# Altium project Antenny_v6.PrjPcb (part 1 of 2)
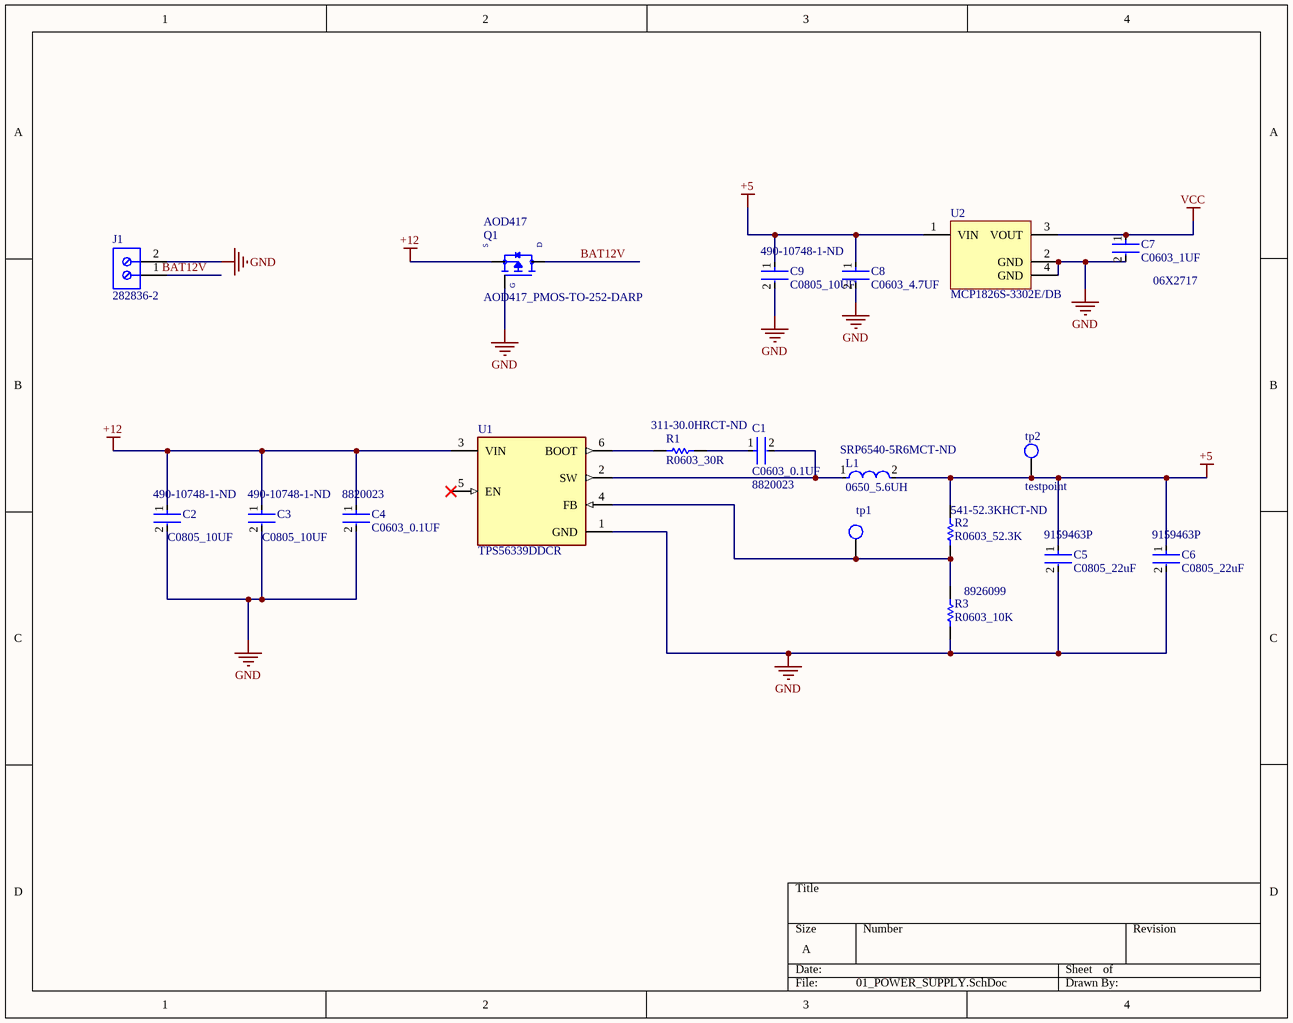
[diagram p0: 01_POWER_SUPPLY.SchDoc]
6 sheets, 81 parts. Net scope: global (net labels, ports and power ports of the same name join across sheets).
Board file: Antenny_v6.PcbDoc
Sheets:
  01_POWER_SUPPLY.SchDoc
  02_USB2UART.SchDoc
  03_PUSHBUTTON.SchDoc
  04_PWMDRIVER.SchDoc
  05_ESP32.SchDoc
  06_LED_ARRAY.SchDoc

## Sheet 01_POWER_SUPPLY.SchDoc
size A; SheetNumber: 1; SheetTotal: 6

### Parts
C1  C0603_0.1UF  Supplier Part Number 1: 8820023  [FP-C0603C-CF-IPC_B]
C2  C0805_10UF  Supplier Part Number 1: 490-10748-1-ND  [FP-C0805C-DN-IPC_A]
C3  C0805_10UF  Supplier Part Number 1: 490-10748-1-ND  [FP-C0805C-DN-IPC_A]
C4  C0603_0.1UF  Supplier Part Number 1: 8820023  [FP-C0603C-CF-IPC_B]
C5  C0805_22uF  Supplier Part Number 1: 9159463P  [FP-C0805C-DN-IPC_A]
C6  C0805_22uF  Supplier Part Number 1: 9159463P  [FP-C0805C-DN-IPC_A]
C7  C0603_1UF  Supplier Part Number 1: 06X2717  [FP-C0603C-CF-IPC_B]
C8  C0603_4.7UF  [FP-C0603C-CF-IPC_B]
C9  C0805_10UF  Supplier Part Number 1: 490-10748-1-ND  [FP-C0805C-DN-IPC_A]
J1  282836-2  [TECO-282836-2_V]
L1  0650_5.6UH  Supplier Part Number 1: SRP6540-5R6MCT-ND  [FP-SRP6540-MFG]
Q1  AOD417_PMOS-TO-252-DARP  Supplier Part Number 1: AOD417  [DPAK228P994X240_3N]
R1  R0603_30R  Supplier Part Number 1: 311-30.0HRCT-ND  [RESC1609X55X30LL15T15]
R2  R0603_52.3K  Supplier Part Number 1: 541-52.3KHCT-ND  [RESC1609X55X30LL15T15]
R3  R0603_10K  Supplier Part Number 1: 8926099  [RESC1609X55X30LL15T15]
tp1  testpoint  [testpoint_1mm]  (value not drawn)
tp2  testpoint  [testpoint_1mm]
U1  TPS56339DDCR  [FP-DDC0006A-MFG]
U2  MCP1826S-3302E/DB  [SOT-223-DB3_L]

### Nets
+5: C5.1 C6.1 C8.1 C9.1 L1.2 R2.2 tp2.1 U2.1(VIN)
+12: C2.1 C3.1 C4.1 Q1.3(S) U1.3(VIN)
GND: C2.2 C3.2 C4.2 C5.2 C6.2 C7.2 C8.2 C9.2 J1.2 Q1.1(G) R3.1 U1.1(GND) U2.2(GND) U2.4(GND)
VCC: C7.1 U2.3(VOUT)
BAT12V: J1.1 Q1.4(D)
NetC1_1: C1.1 R1.2
NetC1_2: C1.2 L1.1 U1.2(SW)
NetR1_1: R1.1 U1.6(BOOT)
NetR2_1: R2.1 R3.2 tp1.1 U1.4(FB)

Not connected (* = marked no-connect by the designer): U1 5(EN)*

### Library data of the parts
C1 C4 = C0603: Multilayer Ceramic Capacitors MLCC Surface Mount 0603 0.1uF 50 Volts X7R 10%; Manufacturer: Murata; Manufacturer Part Number: GRM188R71H104KA93D; Capacitance: 100nF; Voltage Rating: 50V; Insulation Resistance: 10GR; Supplier 1: Farnell; RoHS: Yes; Category: Ceramic Capacitors; Pricing 1: 10=0.04520, 100=0.02000, 500=0.01550, 1000=0.01360, 2000=0.01130, 4000=0.00980, 20000=0.00730, 40000=0.00720 (GBP); Mount: Surface Mount; Case/Package: 0603; Number of Pins: 2; Case Code (Imperial): 0603; Case Code (Metric): 1608; Material: Ceramic; Contact Plating: Tin,Matte; Dielectric Material: Ceramic; Min Operating Temperature: -55°C; Max Operating Temperature: 125°C; Tolerance: 10%; Dielectric: X7R; Packaging: Tape and Reel; Voltage Rating (DC): 50V; Package Quantity: 1; Termination: SMD/SMT; Voltage: 50V; Length: 1.6mm; Width: 0.8mm; Height: 0.8mm; Thickness: 0.035inch; Depth: 0.8mm; Radiation Hardening: No; REACH SVHC: No SVHC; Lead Free: Lead Free; RoHS Compliant: Yes; ComponentLink1URL: https://datasheet.ciiva.com/19467/1857604-19467681.pdf?src-supplier=Jameco; ComponentLink1Description: https://datasheet.ciiva.com/19467/1857604-19467681.pdf?src-supplier=Jameco; ComponentLink2URL: https://datasheet.ciiva.com/11786/0900766b807a1cab-11786047.pdf?src-supplier=RSComponents; ComponentLink2Description: https://datasheet.ciiva.com/11786/0900766b807a1cab-11786047.pdf?src-supplier=RSComponents; ComponentLink3URL: https://datasheet.ciiva.com/29201/451744-da-01-en-vs-kondensator-0603-29201904.pdf?src-supplier=Conrad; ComponentLink3Description: https://datasheet.ciiva.com/29201/451744-da-01-en-vs-kondensator-0603-29201904.pdf?src-supplier=Conrad; ComponentLink4URL: https://datasheet.ciiva.com/131/partnumbering-e-01-131738.pdf?src-supplier=Digi-Key; ComponentLink4Description: https://datasheet.ciiva.com/131/partnumbering-e-01-131738.pdf?src-supplier=Digi-Key; ComponentLink5URL: https://datasheet.ciiva.com/131/partnumbering-e-01-131739.pdf?src-supplier=Digi-Key; ComponentLink5Description: https://datasheet.ciiva.com/131/partnumbering-e-01-131739.pdf?src-supplier=Digi-Key; ComponentLink6URL: https://datasheet.ciiva.com/131/partnumbering-e-01-131740.pdf?src-supplier=Digi-Key; ComponentLink6Description: https://datasheet.ciiva.com/131/partnumbering-e-01-131740.pdf?src-supplier=Digi-Key; ComponentLink7URL: https://datasheet.ciiva.com/48436/nmgrm-data-en-48436667.pdf?src-supplier=Distrelec; ComponentLink7Description: https://datasheet.ciiva.com/48436/nmgrm-data-en-48436667.pdf?src-supplier=Distrelec; ComponentLink8URL: https://datasheet.ciiva.com/14116/nmgrm-data-en-14116602.pdf?src-supplier=Distrelec; ComponentLink8Description: https://datasheet.ciiva.com/14116/nmgrm-data-en-14116602.pdf?src-supplier=Distrelec; ComponentLink9URL: https://datasheet.ciiva.com/28534/4360-28534245.pdf?src-supplier=Element14; ComponentLink9Description: https://datasheet.ciiva.com/28534/4360-28534245.pdf?src-supplier=Element14; ComponentLink10URL: https://datasheet.ciiva.com/7937/4360-7937659.pdf?src-supplier=Element14; ComponentLink10Description: https://datasheet.ciiva.com/7937/4360-7937659.pdf?src-supplier=Element14; ComponentLink11URL: https://datasheet.ciiva.com/7937/1747470-7937658.pdf?src-supplier=Element14; ComponentLink11Description: https://datasheet.ciiva.com/7937/1747470-7937658.pdf?src-supplier=Element14
C2 C3 C9 = C0805: MURATA - GRM21BR61E106MA73L - SMD Multilayer Ceramic Capacitor, 10 µF, 25 V, 0805 [2012 Metric], ± 20%, X5R, GRM Series; Capacitance: 10uF; Voltage Rating: 25V; ComponentLink2Description: Datasheet; ComponentLink2URL: https://content.kemet.com/datasheets/KEM_C1003_C0G_SMD.pdf; Supplier 1: Digi-Key; Manufacturer: Murata; Manufacturer Part Number: GRM21BR61E106MA73L; RoHS: Yes; Category: Ceramic Capacitors; Pricing 1: 1=0.26000, 10=0.17900, 50=0.11960, 100=0.10170, 500=0.07176, 1000=0.06279 (USD); Mount: Surface Mount; Case/Package: 0805; Case Code (Metric): 2012; Case Code (Imperial): 0805; Weight: 0.000335oz; Min Operating Temperature: -55°C; Max Operating Temperature: 85°C; Tolerance: 20%; Packaging: Tape and Reel; Dielectric: X5R; Termination: SMD/SMT; Resistor Type: Ceramic; Voltage Rating (DC): 25V; Package Quantity: 3000; Length: 2mm; Width: 0.049inch; Height: 1.25mm; Thickness: 0.055inch; Depth: 1.25mm; REACH SVHC: No SVHC; Lead Free: Lead Free; RoHS Compliant: Yes; ComponentLink1URL: http://www.farnell.com/datasheets/2079185.pdf?src-supplier=Farnell; ComponentLink1Description: http://www.farnell.com/datasheets/2079185.pdf?src-supplier=Farnell; ComponentLink3URL: http://www.mouser.com/ds/2/281/c02e-2905.pdf?src-supplier=Mouser; ComponentLink3Description: http://www.mouser.com/ds/2/281/c02e-2905.pdf?src-supplier=Mouser; ComponentLink4URL: http://components.arrow.com/part/dataview/0323_03061623?src-supplier=Arrow+Europe; ComponentLink4Description: http://components.arrow.com/part/dataview/0323_03061623?src-supplier=Arrow+Europe; ComponentLink5URL: https://search.murata.co.jp/Ceramy/image/img/A01X/G101/ENG/GRM21BR61E106MA73-01.pdf?src-supplier=Digi-Key; ComponentLink5Description: https://search.murata.co.jp/Ceramy/image/img/A01X/G101/ENG/GRM21BR61E106MA73-01.pdf?src-supplier=Digi-Key; ComponentLink6URL: http://www.farnell.com/datasheets/2079185.pdf?src-supplier=Element14; ComponentLink6Description: http://www.farnell.com/datasheets/2079185.pdf?src-supplier=Element14
  C2 C3: Stock 1: 272100
  C9: Stock 1: 263487
C5 C6 = C0805: TDK - C2012X7S1A226M125AC - SMD Multilayer Ceramic Capacitor, 22 µF, 10 V, 0805 [2012 Metric], ± 20%, X7S, C Series; Capacitance: 22uF; Voltage Rating: 10V; ComponentLink2Description: Datasheet; ComponentLink2URL: https://content.kemet.com/datasheets/KEM_C1003_C0G_SMD.pdf; Supplier 1: RSComponents; Manufacturer: TDK; Manufacturer Part Number: C2012X7S1A226M125AC; RoHS: Yes; Category: Ceramic Capacitors; Stock 1: 1; Pricing 1: 5=0.92400, 25=0.86000, 100=0.75800, 250=0.62800, 500=0.51700 (USD); Mount: Surface Mount; Case/Package: 0805; Case Code (Metric): 2012; Case Code (Imperial): 0805; Weight: 0.000194oz; Dielectric Material: Ceramic; Min Operating Temperature: -55°C; Max Operating Temperature: 125°C; Package Quantity: 2000; Packaging: Tape and Reel; Tolerance: 20%; Dielectric: X7S; Termination: SMD/SMT; Voltage Rating (DC): 10V; Series: C; Length: 0.079inch; Width: 1.25mm; Height: 1.25mm; Thickness: 0.057inch; REACH SVHC: No SVHC; Lead Free: Lead Free; RoHS Compliant: Yes; ComponentLink1URL: https://datasheet.ciiva.com/14893/tdkmlcccaprange-14893287.pdf?src-supplier=Digi-Key; ComponentLink1Description: https://datasheet.ciiva.com/14893/tdkmlcccaprange-14893287.pdf?src-supplier=Digi-Key; ComponentLink3URL: https://datasheet.ciiva.com/14893/tdkmlcccaprange-14893288.pdf?src-supplier=Digi-Key; ComponentLink3Description: https://datasheet.ciiva.com/14893/tdkmlcccaprange-14893288.pdf?src-supplier=Digi-Key; ComponentLink4URL: https://datasheet.ciiva.com/14893/tdkmlcccaprange-14893289.pdf?src-supplier=Digi-Key; ComponentLink4Description: https://datasheet.ciiva.com/14893/tdkmlcccaprange-14893289.pdf?src-supplier=Digi-Key
C7 = C0603: 0603 1 uF 50 V ±10% Tolerance X5R Surface Mount Multilayer Ceramic Capacitor; Manufacturer: Taiyo Yuden; Manufacturer Part Number: UMK107BJ105KA-T; Capacitance: 1uF; Voltage Rating: 50V; Supplier 1: Newark; RoHS: Yes; Category: Ceramic Capacitors; Stock 1: 80000; Pricing 1: 4000=0.05100, 8000=0.04300, 16000=0.03800, 24000=0.03500 (USD); Mount: Surface Mount; Case/Package: 0603; Number of Pins: 2; Case Code (Metric): 1608; Case Code (Imperial): 0603; Contact Plating: Nickel; Min Operating Temperature: -55°C; Max Operating Temperature: 85°C; Tolerance: 10%; Packaging: Tape and Reel; Package Quantity: 1; Voltage Rating (DC): 50V; Termination: SMD/SMT; Dielectric: X5R; Series: M; Construction: Flat; Length: 1.6mm; Width: 0.031inch; Height: 0.8mm; Depth: 0.8mm; Thickness: 0.035inch; Radiation Hardening: No; REACH SVHC: Unknown; RoHS Compliant: Yes; Halogen Free: Halogen Free; ComponentLink1URL: https://datasheet.ciiva.com/134/umk107bj105ka-t-ss-134740.pdf?src-supplier=Digi-Key; ComponentLink1Description: https://datasheet.ciiva.com/134/umk107bj105ka-t-ss-134740.pdf?src-supplier=Digi-Key; ComponentLink2URL: https://datasheet.ciiva.com/11601/umk107bj105ka-t-ss-11601811.pdf?src-supplier=Avnet; ComponentLink2Description: https://datasheet.ciiva.com/11601/umk107bj105ka-t-ss-11601811.pdf?src-supplier=Avnet; ComponentLink3URL: https://datasheet.ciiva.com/5744/1697715-5744913.pdf?src-supplier=Farnell; ComponentLink3Description: https://datasheet.ciiva.com/5744/1697715-5744913.pdf?src-supplier=Farnell; ComponentLink4URL: https://datasheet.ciiva.com/30199/43umk107bj105ka-t-30199791.pdf?src-supplier=Onlinecomponents.com; ComponentLink4Description: https://datasheet.ciiva.com/30199/43umk107bj105ka-t-30199791.pdf?src-supplier=Onlinecomponents.com; ComponentLink5URL: https://datasheet.ciiva.com/15922/336umk107bj105ka-t-15922611.pdf?src-supplier=Onlinecomponents.com; ComponentLink5Description: https://datasheet.ciiva.com/15922/336umk107bj105ka-t-15922611.pdf?src-supplier=Onlinecomponents.com; ComponentLink6URL: https://datasheet.ciiva.com/5427/mlcc-all-e-541559-5427036.pdf?src-supplier=Mouser; ComponentLink6Description: https://datasheet.ciiva.com/5427/mlcc-all-e-541559-5427036.pdf?src-supplier=Mouser; ComponentLink7URL: https://datasheet.ciiva.com/7975/mlcc-all-e-7975898.pdf?src-supplier=Element14; ComponentLink7Description: https://datasheet.ciiva.com/7975/mlcc-all-e-7975898.pdf?src-supplier=Element14; ComponentLink8URL: https://datasheet.ciiva.com/7975/1697715-7975608.pdf?src-supplier=Element14; ComponentLink8Description: https://datasheet.ciiva.com/7975/1697715-7975608.pdf?src-supplier=Element14; ComponentLink9URL: https://datasheet.ciiva.com/22694/1697715-22694278.pdf?src-supplier=Element14; ComponentLink9Description: https://datasheet.ciiva.com/22694/1697715-22694278.pdf?src-supplier=Element14
C8 = C0603: CAP CER 4.7UF 0603; Manufacturer: Murata; Manufacturer Part Number: GRM155R60J475ME47D; Tolerance: 20%; Dielectric: X5R; Voltage Rating (DC): 6.3V; RoHS: Yes; Category: Ceramic Capacitors; Stock 1: 420000; Pricing 1: 10000=0.01960, 20000=0.01861, 40000=0.01762, 60000=0.01663, 80000=0.01564, 100000=0.01465, 1000000=0.01366 (USD); Mount: Surface Mount; Case/Package: 0402; Case Code (Metric): 1005; Case Code (Imperial): 0402; Contact Plating: Tin; Weight: 0.000212oz; Min Operating Temperature: -55°C; Max Operating Temperature: 85°C; Package Quantity: 10000; Capacitance: 4.7uF; Packaging: Cut Tape; Voltage Rating: 6.3V; Termination: Standard; Series: GRM; Voltage: 6.3V; Length: 1mm; Width: 0.5mm; Height: 0.5mm; Thickness: 0.022inch; Depth: 0.5mm; REACH SVHC: No SVHC; Lead Free: Lead Free; RoHS Compliant: Yes; ComponentLink1URL: https://datasheet.ciiva.com/6270/product-6270483.pdf?src-supplier=Digi-Key; ComponentLink1Description: https://datasheet.ciiva.com/6270/product-6270483.pdf?src-supplier=Digi-Key; ComponentLink2URL: https://datasheet.ciiva.com/6268/partnumbering-e-01-6268378.pdf?src-supplier=Digi-Key; ComponentLink2Description: https://datasheet.ciiva.com/6268/partnumbering-e-01-6268378.pdf?src-supplier=Digi-Key; ComponentLink3URL: https://datasheet.ciiva.com/6268/partnumbering-e-01-6268382.pdf?src-supplier=Digi-Key; ComponentLink3Description: https://datasheet.ciiva.com/6268/partnumbering-e-01-6268382.pdf?src-supplier=Digi-Key; ComponentLink4URL: https://datasheet.ciiva.com/46418/1769893-46418045.pdf?src-supplier=Element14; ComponentLink4Description: https://datasheet.ciiva.com/46418/1769893-46418045.pdf?src-supplier=Element14; ComponentLink5URL: https://datasheet.ciiva.com/46418/1769893-46418044.pdf?src-supplier=Element14; ComponentLink5Description: https://datasheet.ciiva.com/46418/1769893-46418044.pdf?src-supplier=Element14
J1 = CMP-1684-00017-1: Female Header, Pitch 5 mm, 1 x 2 Position, Height 10 mm, Tail Length 3.5 mm, Rohs, Bulk; Manufacturer: TE Connectivity; Wire Gauge: 16-30AWG; Product Training Modules: Wire-to-BoardEurostyleTerminalBlocks; Clamp Material - Plating: Brass-NickelPlated; Voltage: 300V; Mating Orientation: HorizontalwithBoard; Current: 13.5A; Pitch: 0.197"(5.00mm); Screw Thread: M3; 3D Model: 282836-2.pdf; Other Names: 5ULV-02B / A98076; Dynamic Catalog: BuchananSeries; Number of Levels: 1; Torque - Screw: 0.68Nm(6Lb-In); Featured Product: EurostyleTerminalBlockConnectors; Positions Per Level: 2; Wire Termination: Screw-RisingCageClamp; Datasheet URL: http://www.te.com.cn/commerce/DocumentDelivery/DDEController?Action=showdoc&DocId=Catalog+Section%7F1308389_EUROSTYLE_TERMINAL_BLOCKS%7F0607%7Fpdf%7FEnglish%7FENG_CS_1308389_EUROSTYLE_TERMINAL_BLOCKS_0607.pdf%7F282836-2; Color: Green; Family: TerminalBlocks-WiretoBoard; RoHS Information: 282836-2StatementofCompliance; Standard Package: 300; Contact Material - Plating: Brass-TinPlated; Manufacturer URL: http://www.te.com; Housing Material: Polyamide(PA66),Nylon6/6; Features: Interlocking(Side); Package Description: Female Header, Pitch 5 mm, 1 x 2 Position, Height 10 mm, Tail Length 3.5 mm; Mounting Type: ThroughHole; Package Reference: THD; Packaging: Bulk; Series: Buchanan; Category: Connectors,Interconnects; Screw Material - Plating: Brass-NickelPlated
L1 = SRP6540: 0650_5.6UH, made in china; Manufacturer: Bourns; Manufacturer Part Number: SRP6540-5R6M; Core Material: Ferrite; Inductance Tolerance: 20%; Shielding: Shielded; Inductance: 5.6uH; Current Rating: 5.5A; Saturation Current: 6A; DC Resistance (DCR): 38mR; Test Frequency: 100kHz; ComponentLink2URL: https://www.bourns.com/docs/Product-Datasheets/SRP6540.pdf; Package: SRP6540; ComponentLink2Description: Datasheet; Supplier 1: Digi-Key; RoHS: Yes; Category: Fixed Inductors; Stock 1: 95; Pricing 1: 1=1.43000, 10=1.32600, 25=1.22360, 50=1.01980, 100=0.95860, 250=0.85664, 500=0.73426 (USD); Mount: Surface Mount; Case/Package: 2826; Material: Ferrite; Contact Plating: Tin; Min Operating Temperature: -55°C; Max Operating Temperature: 125°C; Tolerance: 20%; Packaging: Tape and Reel; Package Quantity: 1200; Resistor Type: Wirewound; Max DC Current: 5.5A; Termination: SMD/SMT; RMS Current (Irms): 5.5A; Self Resonant Frequency: 100kHz; Series: SRP6540; Sample Rate (Hz): 100kHz; Length: 7.2mm; Width: 6.5mm; Height: 4mm; Height - Seated (Max): 0.157inch; Depth: 6.7mm; REACH SVHC: No SVHC; Military Standard: Not; ComponentLink1URL: https://datasheet.ciiva.com/15022/srp6540-15022023.pdf?src-supplier=Digi-Key; ComponentLink1Description: https://datasheet.ciiva.com/15022/srp6540-15022023.pdf?src-supplier=Digi-Key; ComponentLink3URL: https://datasheet.ciiva.com/15022/srp6540-15022024.pdf?src-supplier=Digi-Key; ComponentLink3Description: https://datasheet.ciiva.com/15022/srp6540-15022024.pdf?src-supplier=Digi-Key; ComponentLink4URL: https://datasheet.ciiva.com/15022/srp6540-15022025.pdf?src-supplier=Digi-Key; ComponentLink4Description: https://datasheet.ciiva.com/15022/srp6540-15022025.pdf?src-supplier=Digi-Key; ComponentLink5URL: https://datasheet.ciiva.com/17055/70281705-17055175.pdf?src-supplier=Allied+Electronics; ComponentLink5Description: https://datasheet.ciiva.com/17055/70281705-17055175.pdf?src-supplier=Allied+Electronics; ComponentLink6URL: https://datasheet.ciiva.com/28679/1698468-28679621.pdf?src-supplier=Element14; ComponentLink6Description: https://datasheet.ciiva.com/28679/1698468-28679621.pdf?src-supplier=Element14
Q1 = PMOS: Trans MOSFET P-CH 30V 25A 3-Pin(2+Tab) DPAK; Manufacturer: Alpha & Omega Semiconductor; Rds On Max: 34mR; Input Capacitance: 920pF; Max Power Dissipation: 2.5W; Number of Elements: 1; Gate to Source Voltage (Vgs): 20V; Supplier 1: Arrow Electronics; Manufacturer Part Number: AOD417; RoHS: Yes; Category: MOSFETs; Stock 1: 7; Pricing 1: 1=0.61400, 2500=0.47000, 25000=0.43700, 250000=0.25070, 1250000=0.16350, 2500000=0.16290, 25000=0.43560, 250000=0.24230, 1250000=0.15210, 2500000=0.15150 (USD); Mount: Surface Mount; Case/Package: TO-252-3; Number of Pins: 3; Min Operating Temperature: -55°C; Max Operating Temperature: 175°C; Packaging: Tape and Reel; Drain to Source Voltage (Vdss): 30V; Continuous Drain Current (ID): 25A; Power Dissipation: 2.5W; Series: -; Lead Free: Lead Free; RoHS Compliant: Yes; ComponentLink1URL: https://datasheet.ciiva.com/940/aod417-940788.pdf?src-supplier=Digi-Key; ComponentLink1Description: https://datasheet.ciiva.com/940/aod417-940788.pdf?src-supplier=Digi-Key; ComponentLink2URL: https://datasheet.ciiva.com/940/aod417-940790.pdf?src-supplier=Digi-Key; ComponentLink2Description: https://datasheet.ciiva.com/940/aod417-940790.pdf?src-supplier=Digi-Key
R1 = R0603: Resistor;Resistance:30Rohm;Resistance Tolerance:± 1%;Resistor Element Material:Thick Film;Resistor Case Style:0603; Manufacturer: Yageo; Manufacturer Part Number: RC0603FR-0730RL; Resistance: 30R; Temperature Coefficient: 100ppm/°C; Voltage Rating (DC): 50V; Power Rating: 100mW; Supplier 1: Digi-Key; RoHS: Yes; Category: Chip SMD Resistors; Stock 1: 13188; Pricing 1: 1=0.10000, 10=0.02400, 100=0.00970, 1000=0.00436, 2500=0.00378 (USD); Mount: Surface Mount; Case/Package: 0603; Case Code (Metric): 1608; Case Code (Imperial): 0603; Size Code: 0603; Min Operating Temperature: -55°C; Max Operating Temperature: 155°C; Tolerance: 1%; Resistor Type: Thick Film; Packaging: Tape and Reel; Package Quantity: 1; Voltage Rating: 50V; Number of Terminations: 2; Termination: SMD/SMT; Max Power Dissipation: 100mW; Features: Moisture Resistant; Series: RC; Construction: Rectangular; Technology: THICK FILM; Length: 0.063inch; Width: 0.031inch; Height: 0.022inch; Depth: 0.8mm; Lead Free: Lead Free; Military Standard: Not; RoHS Compliant: Yes; ComponentLink1URL: https://datasheet.ciiva.com/11819/0900766b80c66297-11819676.pdf?src-supplier=RSComponents; ComponentLink1Description: https://datasheet.ciiva.com/11819/0900766b80c66297-11819676.pdf?src-supplier=RSComponents; ComponentLink2URL: https://datasheet.ciiva.com/2455/pyu-r-int-thick-7-2455119.pdf?src-supplier=Digi-Key; ComponentLink2Description: https://datasheet.ciiva.com/2455/pyu-r-int-thick-7-2455119.pdf?src-supplier=Digi-Key; ComponentLink3URL: https://datasheet.ciiva.com/2455/pyu-r-int-thick-7-2455120.pdf?src-supplier=Digi-Key; ComponentLink3Description: https://datasheet.ciiva.com/2455/pyu-r-int-thick-7-2455120.pdf?src-supplier=Digi-Key; ComponentLink4URL: https://datasheet.ciiva.com/2455/pyu-r-int-thick-7-2455121.pdf?src-supplier=Digi-Key; ComponentLink4Description: https://datasheet.ciiva.com/2455/pyu-r-int-thick-7-2455121.pdf?src-supplier=Digi-Key
R2 = R0603: Res Thick Film 0603 52.3K Ohm 1% 0.1W(1/10W) ±100ppm/C Pad SMD Automotive T/R; Manufacturer: Vishay; Manufacturer Part Number: CRCW060352K3FKEA; Resistance: 52.3kR; Power Rating: 100mW; Temperature Coefficient: 100ppm/°C; Voltage Rating: 75V; Supplier 1: Digi-Key; RoHS: Yes; Category: Chip SMD Resistors; Stock 1: 93162; Pricing 1: 1=0.10000, 10=0.03800, 100=0.01560, 1000=0.00701, 2500=0.00608 (USD); Case/Package: 0603; Number of Pins: 2; Weight: 7.1E-05oz; Case Code (Metric): 1608; Case Code (Imperial): 0603; Contact Plating: Tin; Size Code: 0603; Min Operating Temperature: -55°C; Max Operating Temperature: 155°C; Tolerance: 1%; Packaging: Tape and Reel; Package Quantity: 10; Resistor Type: Thick Film; Number of Terminations: 2; Termination: SMD/SMT; Max Power Dissipation: 100mW; Features: Automotive AEC-Q200; Series: CRCW; Technology: THICK FILM; Resistance Tolerance: 1%; Construction: Rectangular; Length: 1.55mm; Width: 0.033inch; Height: 0.45mm; Depth: 0.85mm; Radiation Hardening: No; RoHS Compliant: Yes; REACH SVHC: Unknown; Military Standard: Not; ComponentLink1URL: https://datasheet.ciiva.com/5541/dcrcwe3-109170-5541062.pdf?src-supplier=Mouser; ComponentLink1Description: https://datasheet.ciiva.com/5541/dcrcwe3-109170-5541062.pdf?src-supplier=Mouser; ComponentLink2URL: https://datasheet.ciiva.com/3257/dcrcwe3-3257708.pdf?src-supplier=Avnet; ComponentLink2Description: https://datasheet.ciiva.com/3257/dcrcwe3-3257708.pdf?src-supplier=Avnet; ComponentLink3URL: https://datasheet.ciiva.com/2466/dcrcwe3-2466068.pdf?src-supplier=Digi-Key; ComponentLink3Description: https://datasheet.ciiva.com/2466/dcrcwe3-2466068.pdf?src-supplier=Digi-Key; ComponentLink4URL: https://datasheet.ciiva.com/2466/dcrcwe3-2466069.pdf?src-supplier=Digi-Key; ComponentLink4Description: https://datasheet.ciiva.com/2466/dcrcwe3-2466069.pdf?src-supplier=Digi-Key; ComponentLink5URL: https://datasheet.ciiva.com/2466/dcrcwe3-2466070.pdf?src-supplier=Digi-Key; ComponentLink5Description: https://datasheet.ciiva.com/2466/dcrcwe3-2466070.pdf?src-supplier=Digi-Key; ComponentLink6URL: https://datasheet.ciiva.com/16426/dcrcwe3-16426232.pdf?src-supplier=Future+Electronics; ComponentLink6Description: https://datasheet.ciiva.com/16426/dcrcwe3-16426232.pdf?src-supplier=Future+Electronics; ComponentLink7URL: https://datasheet.ciiva.com/16760/70201119-16760489.pdf?src-supplier=Allied+Electronics; ComponentLink7Description: https://datasheet.ciiva.com/16760/70201119-16760489.pdf?src-supplier=Allied+Electronics; ComponentLink8URL: https://datasheet.ciiva.com/7792/125364-7792327.pdf?src-supplier=Element14; ComponentLink8Description: https://datasheet.ciiva.com/7792/125364-7792327.pdf?src-supplier=Element14; ComponentLink9URL: https://datasheet.ciiva.com/22702/1697337-22702730.pdf?src-supplier=Element14; ComponentLink9Description: https://datasheet.ciiva.com/22702/1697337-22702730.pdf?src-supplier=Element14; ComponentLink10URL: https://datasheet.ciiva.com/7816/1697337-7816042.pdf?src-supplier=Element14; ComponentLink10Description: https://datasheet.ciiva.com/7816/1697337-7816042.pdf?src-supplier=Element14; ComponentLink11URL: https://datasheet.ciiva.com/7816/1697337-7816043.pdf?src-supplier=Element14; ComponentLink11Description: https://datasheet.ciiva.com/7816/1697337-7816043.pdf?src-supplier=Element14; ComponentLink12URL: https://datasheet.ciiva.com/22870/70201119-22870776.pdf?src-supplier=Allied+Electronics; ComponentLink12Description: https://datasheet.ciiva.com/22870/70201119-22870776.pdf?src-supplier=Allied+Electronics
R3 = R0603: VISHAY - CRCW060310K0FKEA - RES, THICK FILM, 10K, 1%, 0.1W, 0603; Resistance: 10kR; Temperature Coefficient: 100ppm/°C; Power Rating: 100mW; Voltage Rating: 75V; Supplier 1: Future Electronics; Manufacturer: Vishay; Manufacturer Part Number: CRCW060310K0FKEA; RoHS: Yes; Category: Chip SMD Resistors; Stock 1: 1870000; Pricing 1: 5000=0.00790 (USD); Case/Package: 0603; Number of Pins: 2; Contact Plating: Tin,Lead; Weight: 7.1E-05oz; Case Code (Metric): 1608; Case Code (Imperial): 0603; Size Code: 0603; Min Operating Temperature: -55°C; Max Operating Temperature: 155°C; Tolerance: 1%; Resistor Type: Thick Film; Packaging: Tape and Reel; Package Quantity: 10; Number of Terminations: 2; Termination: SMD/SMT; Max Power Dissipation: 100mW; Voltage Rating (DC): 75V; Features: Automotive AEC-Q200; Series: CRCW; Construction: Rectangular; Resistance Tolerance: 1%; Technology: THICK FILM; Length: 1.55mm; Width: 0.033inch; Height: 0.45mm; Depth: 0.85mm; Radiation Hardening: No; Lead Free: Lead Free; RoHS Compliant: Yes; REACH SVHC: Unknown; Military Standard: Not; ComponentLink1URL: https://datasheet.ciiva.com/11809/0900766b80d98afc-11809037.pdf?src-supplier=RSComponents; ComponentLink1Description: https://datasheet.ciiva.com/11809/0900766b80d98afc-11809037.pdf?src-supplier=RSComponents; ComponentLink2URL: https://datasheet.ciiva.com/5543/dcrcwe3-109170-5543001.pdf?src-supplier=Mouser; ComponentLink2Description: https://datasheet.ciiva.com/5543/dcrcwe3-109170-5543001.pdf?src-supplier=Mouser; ComponentLink3URL: https://datasheet.ciiva.com/3256/dcrcwe3-3256939.pdf?src-supplier=Avnet; ComponentLink3Description: https://datasheet.ciiva.com/3256/dcrcwe3-3256939.pdf?src-supplier=Avnet; ComponentLink4URL: https://datasheet.ciiva.com/3256/dcrcwe3-3256940.pdf?src-supplier=Avnet; ComponentLink4Description: https://datasheet.ciiva.com/3256/dcrcwe3-3256940.pdf?src-supplier=Avnet; ComponentLink5URL: https://datasheet.ciiva.com/2465/dcrcwe3-2465513.pdf?src-supplier=Digi-Key; ComponentLink5Description: https://datasheet.ciiva.com/2465/dcrcwe3-2465513.pdf?src-supplier=Digi-Key; ComponentLink6URL: https://datasheet.ciiva.com/2465/dcrcwe3-2465514.pdf?src-supplier=Digi-Key; ComponentLink6Description: https://datasheet.ciiva.com/2465/dcrcwe3-2465514.pdf?src-supplier=Digi-Key; ComponentLink7URL: https://datasheet.ciiva.com/2465/dcrcwe3-2465515.pdf?src-supplier=Digi-Key; ComponentLink7Description: https://datasheet.ciiva.com/2465/dcrcwe3-2465515.pdf?src-supplier=Digi-Key; ComponentLink8URL: https://datasheet.ciiva.com/26821/getdatasheetpartid-86831-26821109.pdf?src-supplier=Verical; ComponentLink8Description: https://datasheet.ciiva.com/26821/getdatasheetpartid-86831-26821109.pdf?src-supplier=Verical; ComponentLink9URL: https://datasheet.ciiva.com/16754/70201119-16754710.pdf?src-supplier=Allied+Electronics; ComponentLink9Description: https://datasheet.ciiva.com/16754/70201119-16754710.pdf?src-supplier=Allied+Electronics; ComponentLink10URL: https://datasheet.ciiva.com/16719/70201119-16719704.pdf?src-supplier=Allied+Electronics; ComponentLink10Description: https://datasheet.ciiva.com/16719/70201119-16719704.pdf?src-supplier=Allied+Electronics; ComponentLink11URL: https://datasheet.ciiva.com/16886/dcrcw-16886037.pdf?src-supplier=Avnet+Europe; ComponentLink11Description: https://datasheet.ciiva.com/16886/dcrcw-16886037.pdf?src-supplier=Avnet+Europe; ComponentLink12URL: https://datasheet.ciiva.com/26314/fld-crcw-e3-data-en-26314749.pdf?src-supplier=Distrelec; ComponentLink12Description: https://datasheet.ciiva.com/26314/fld-crcw-e3-data-en-26314749.pdf?src-supplier=Distrelec; ComponentLink13URL: https://datasheet.ciiva.com/16209/dcrcwe3-16209164.pdf?src-supplier=Future+Electronics; ComponentLink13Description: https://datasheet.ciiva.com/16209/dcrcwe3-16209164.pdf?src-supplier=Future+Electronics; ComponentLink14URL: https://datasheet.ciiva.com/46385/1697337-46385498.pdf?src-supplier=Element14; ComponentLink14Description: https://datasheet.ciiva.com/46385/1697337-46385498.pdf?src-supplier=Element14
U1 = CMP-04918-000012-1: PWR MGMT SPECIALIZED REGULATOR; Manufacturer: Texas Instruments; Output Type: AdjustableProgrammable; Max Supply Voltage: 24V; Min Supply Voltage: 4.5V; Nominal Supply Current: 98uA; Max Duty Cycle: 97%; Number Of Outputs: 1; Output Current: 3A; Switching Topology: Buck; Standoff Height: 0mm; Switching Frequency: 500kHz; Output Voltage: 0.8-16V; Max Junction Temp: +125°C; ComponentLink2Description: Datasheet; ComponentLink2URL: http://www.ti.com/lit/ds/symlink/tps56339.pdf; Package: DDC0006A; RoHS: TRUE; Temperature: -40°C to +125°C; Temperature Range Low: -40°C; Device Class L3: Voltage Regulators - Switching; Temperature Range High: +125°C; Device Class L2: Power Management ICs; Device Class L1: Integrated Circuits (ICs); Category: IC; Manufacturer Part Number: TPS56339DDCR; Octopart: https://octopart.com/tps56339ddcr-texas+instruments-101466410; Automotive: No; Height: 1.1mm; Digikey Description: PWR MGMT SPECIALIZED REGULATOR; Lead Free: Yes; Mouser Description: 4.5-V to 24-V input, 3-A output synchronous buck converter 6-SOT-23-THIN -40 to 125
U2 = CMP-0136-00504-1: 1000 mA, Low Voltage, Low Quiescent Current LDO Regulator, 3-Pin SOT-223, Extended Temperature; PackageVersion: revBB, Aug-2009; PackageReference: SOT-223-DB3; DatasheetVersion: revA, Aug-2007; PackageDescription: 3-Lead Plastic Small Outline Transistor (DB) [SOT-223]

## Sheet 02_USB2UART.SchDoc
size A; SheetNumber: 2; SheetTotal: 6
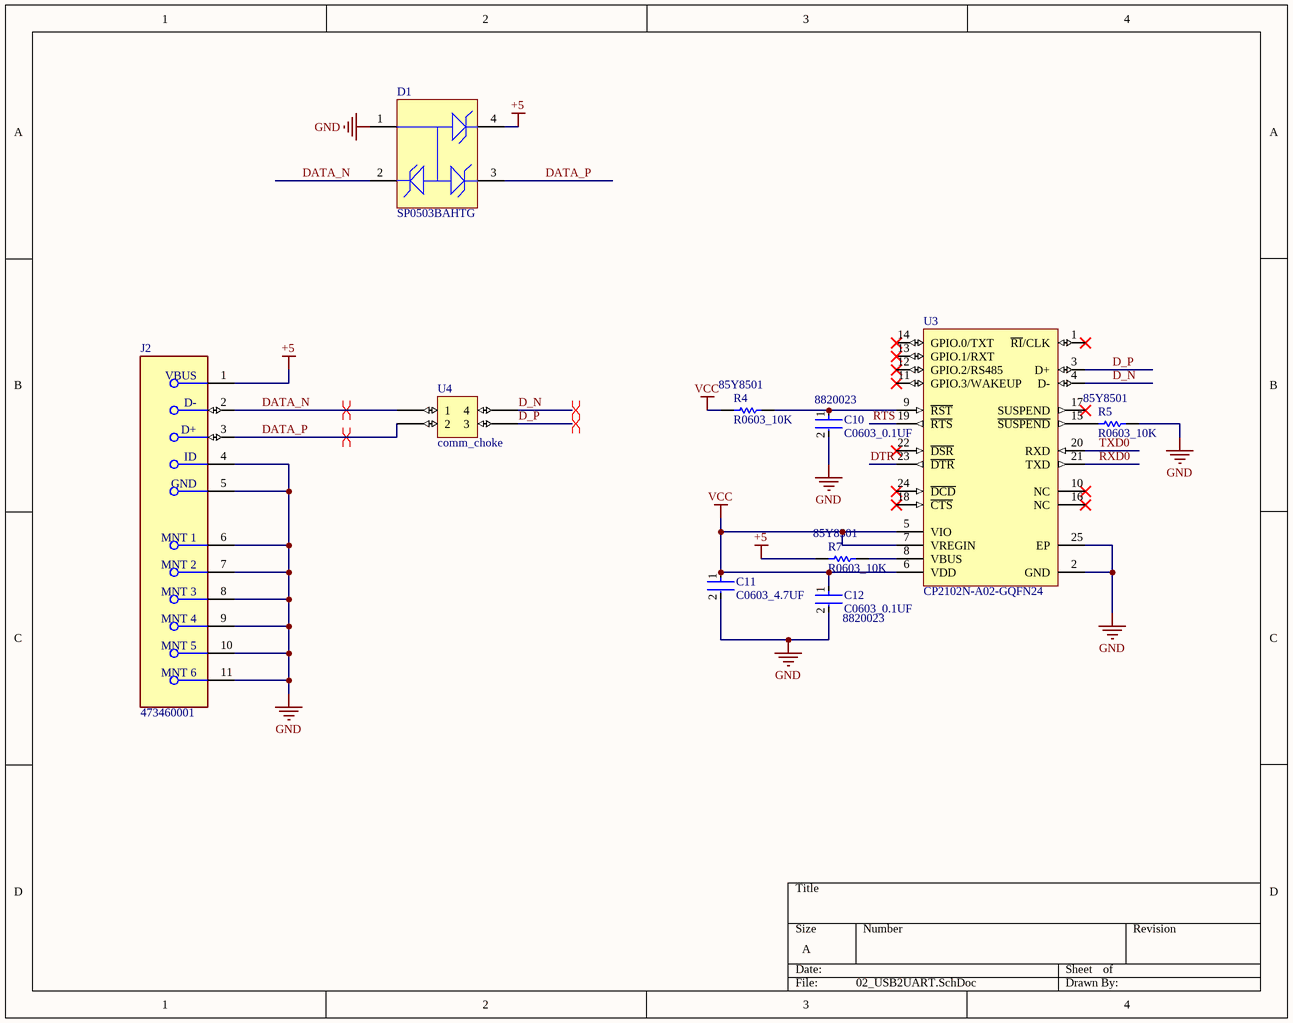
[diagram p1: 02_USB2UART.SchDoc]

### Parts
C10  C0603_0.1UF  Supplier Part Number 1: 8820023  [FP-C0603C-CF-IPC_B]
C11  C0603_4.7UF  [FP-C0603C-CF-IPC_B]
C12  C0603_0.1UF  Supplier Part Number 1: 8820023  [FP-C0603C-CF-IPC_B]
D1  SP0503BAHTG  [LFUS-SOT143-4_V]
J2  473460001  [FP-473460001-MFG]
R4  R0603_10K  Supplier Part Number 1: 85Y8501  [RESC1609X55X30LL15T15]
R5  R0603_10K  Supplier Part Number 1: 85Y8501  [RESC1609X55X30LL15T15]
R7  R0603_10K  Supplier Part Number 1: 85Y8501  [RESC1609X55X30LL15T15]
U3  CP2102N-A02-GQFN24  [SLAB-QFN-24-2550x2550TP_A_V]
U4  comm_choke  [EXC14CE900U]

### Nets
+5: D1.4 J2.1(VBUS) R7.1
GND: C10.2 C11.2 C12.2 D1.1 J2.4(ID) J2.5(GND) J2.6(MNT_1) J2.7(MNT_2) J2.8(MNT_3) J2.9(MNT_4) J2.10(MNT_5) J2.11(MNT_6) R5.2 U3.2(GND) U3.25(EP)
VCC: C11.1 C12.1 R4.1 U3.5(VIO) U3.6(VDD) U3.7(VREGIN)
D_N: U3.4(D-) U4.4
D_P: U3.3(D+) U4.3
DATA_N: D1.2 J2.2(D-) U4.1
DATA_P: D1.3 J2.3(D+) U4.2
DTR: U3.23(~{DTR})
RTS: U3.19(~{RTS})
RXD0: U3.21(TXD)
TXD0: U3.20(RXD)
NetC10_1: C10.1 R4.2 U3.9(~{RST})
NetR5_1: R5.1 U3.15(~{SUSPEND})
NetR7_2: R7.2 U3.8(VBUS)

Not connected (* = marked no-connect by the designer): U3 1(~{RI}/CLK)* 10(NC)* 11(GPIO.3/WAKEUP)* 12(GPIO.2/RS485)* 13(GPIO.1/RXT)* 14(GPIO.0/TXT)* 16(NC)* 17(SUSPEND)* 18(~{CTS})* 22(~{DSR})* 24(~{DCD})*

### Layout directives
differential pair: D_N, D_P, DATA_N, DATA_P

### Library data of the parts
C10 C12 = C0603: as C1 on sheet 01_POWER_SUPPLY; Supplier 1: Farnell; RoHS: Yes; Category: Ceramic Capacitors; Pricing 1: 10=0.04520, 100=0.02000, 500=0.01550, 1000=0.01360, 2000=0.01130, 4000=0.00980, 20000=0.00730, 40000=0.00720 (GBP); Mount: Surface Mount; Case/Package: 0603; Number of Pins: 2; Case Code (Imperial): 0603; Case Code (Metric): 1608; Material: Ceramic; Contact Plating: Tin,Matte; Dielectric Material: Ceramic; Min Operating Temperature: -55°C; Max Operating Temperature: 125°C; Tolerance: 10%; Dielectric: X7R; Packaging: Tape and Reel; Voltage Rating (DC): 50V; Package Quantity: 1; Termination: SMD/SMT; Voltage: 50V; Length: 1.6mm; Width: 0.8mm; Height: 0.8mm; Thickness: 0.035inch; Depth: 0.8mm; Radiation Hardening: No; REACH SVHC: No SVHC; Lead Free: Lead Free; RoHS Compliant: Yes; ComponentLink1URL: https://datasheet.ciiva.com/19467/1857604-19467681.pdf?src-supplier=Jameco; ComponentLink1Description: https://datasheet.ciiva.com/19467/1857604-19467681.pdf?src-supplier=Jameco; ComponentLink2URL: https://datasheet.ciiva.com/11786/0900766b807a1cab-11786047.pdf?src-supplier=RSComponents; ComponentLink2Description: https://datasheet.ciiva.com/11786/0900766b807a1cab-11786047.pdf?src-supplier=RSComponents; ComponentLink3URL: https://datasheet.ciiva.com/29201/451744-da-01-en-vs-kondensator-0603-29201904.pdf?src-supplier=Conrad; ComponentLink3Description: https://datasheet.ciiva.com/29201/451744-da-01-en-vs-kondensator-0603-29201904.pdf?src-supplier=Conrad; ComponentLink4URL: https://datasheet.ciiva.com/131/partnumbering-e-01-131738.pdf?src-supplier=Digi-Key; ComponentLink4Description: https://datasheet.ciiva.com/131/partnumbering-e-01-131738.pdf?src-supplier=Digi-Key; ComponentLink5URL: https://datasheet.ciiva.com/131/partnumbering-e-01-131739.pdf?src-supplier=Digi-Key; ComponentLink5Description: https://datasheet.ciiva.com/131/partnumbering-e-01-131739.pdf?src-supplier=Digi-Key; ComponentLink6URL: https://datasheet.ciiva.com/131/partnumbering-e-01-131740.pdf?src-supplier=Digi-Key; ComponentLink6Description: https://datasheet.ciiva.com/131/partnumbering-e-01-131740.pdf?src-supplier=Digi-Key; ComponentLink7URL: https://datasheet.ciiva.com/48436/nmgrm-data-en-48436667.pdf?src-supplier=Distrelec; ComponentLink7Description: https://datasheet.ciiva.com/48436/nmgrm-data-en-48436667.pdf?src-supplier=Distrelec; ComponentLink8URL: https://datasheet.ciiva.com/14116/nmgrm-data-en-14116602.pdf?src-supplier=Distrelec; ComponentLink8Description: https://datasheet.ciiva.com/14116/nmgrm-data-en-14116602.pdf?src-supplier=Distrelec; ComponentLink9URL: https://datasheet.ciiva.com/28534/4360-28534245.pdf?src-supplier=Element14; ComponentLink9Description: https://datasheet.ciiva.com/28534/4360-28534245.pdf?src-supplier=Element14; ComponentLink10URL: https://datasheet.ciiva.com/7937/4360-7937659.pdf?src-supplier=Element14; ComponentLink10Description: https://datasheet.ciiva.com/7937/4360-7937659.pdf?src-supplier=Element14; ComponentLink11URL: https://datasheet.ciiva.com/7937/1747470-7937658.pdf?src-supplier=Element14; ComponentLink11Description: https://datasheet.ciiva.com/7937/1747470-7937658.pdf?src-supplier=Element14
C11 = C0603: as C8 on sheet 01_POWER_SUPPLY; RoHS: Yes; Category: Ceramic Capacitors; Stock 1: 420000; Pricing 1: 10000=0.01960, 20000=0.01861, 40000=0.01762, 60000=0.01663, 80000=0.01564, 100000=0.01465, 1000000=0.01366 (USD); Mount: Surface Mount; Case/Package: 0402; Case Code (Metric): 1005; Case Code (Imperial): 0402; Contact Plating: Tin; Weight: 0.000212oz; Min Operating Temperature: -55°C; Max Operating Temperature: 85°C; Package Quantity: 10000; Capacitance: 4.7uF; Packaging: Cut Tape; Voltage Rating: 6.3V; Termination: Standard; Series: GRM; Voltage: 6.3V; Length: 1mm; Width: 0.5mm; Height: 0.5mm; Thickness: 0.022inch; Depth: 0.5mm; REACH SVHC: No SVHC; Lead Free: Lead Free; RoHS Compliant: Yes; ComponentLink1URL: https://datasheet.ciiva.com/6270/product-6270483.pdf?src-supplier=Digi-Key; ComponentLink1Description: https://datasheet.ciiva.com/6270/product-6270483.pdf?src-supplier=Digi-Key; ComponentLink2URL: https://datasheet.ciiva.com/6268/partnumbering-e-01-6268378.pdf?src-supplier=Digi-Key; ComponentLink2Description: https://datasheet.ciiva.com/6268/partnumbering-e-01-6268378.pdf?src-supplier=Digi-Key; ComponentLink3URL: https://datasheet.ciiva.com/6268/partnumbering-e-01-6268382.pdf?src-supplier=Digi-Key; ComponentLink3Description: https://datasheet.ciiva.com/6268/partnumbering-e-01-6268382.pdf?src-supplier=Digi-Key; ComponentLink4URL: https://datasheet.ciiva.com/46418/1769893-46418045.pdf?src-supplier=Element14; ComponentLink4Description: https://datasheet.ciiva.com/46418/1769893-46418045.pdf?src-supplier=Element14; ComponentLink5URL: https://datasheet.ciiva.com/46418/1769893-46418044.pdf?src-supplier=Element14; ComponentLink5Description: https://datasheet.ciiva.com/46418/1769893-46418044.pdf?src-supplier=Element14
D1 = CMP-2000-05191-1: TVS Diode Array, 30 pF, 30 KV, -40 to 85 degC, 4-Pin SOT143, RoHS, Tape and Reel; Manufacturer: Littelfuse; Direction Type: Uni-Directional; Product Height (mm): 1.05mm; Leakage Current (Max): 0.1uA; Clamping Voltage (Max): 8V; Reverse Stand-off Voltage: 5.5(Min)V; Configuration: Triple; Working Voltage: 5.5V; Product Length (mm): 3.04mm; Working Voltage (Max): 5.5V(Min); Capacitance Value: 30pF; Rad Hardened: No; Number of Elements: 3; Product Depth (mm): 1.4mm; Operating Temperature Max Deg. C: 85C; Suppressor Type: TVS; Operating Temperature Min Deg. C: -40C; Operating Temp Range: -40Cto85C; Mounting: SurfaceMount; Package / Case: SOT-143; Datasheet Version: Dec-13; Package Type: SOT-143; Packaging: TapeandReel; Pin Count: 3+Tab; Operating Temperature Classification: Industrial; Datasheet URL: https://datasheet.ciiva.com/15143/getdatasheetpartid-116020-15143550.pdf; Manufacturer URL: http://www.littelfuse.com/; Leakage Current: 0.1uA; Mounting Style: SurfaceMount; Clamping Voltage: 8V; Polarity: Uni-Directional
J2 = CMP-2000-05246-2: CONN RCPT USB2.0 MICRO B SMD R/A; Manufacturer: Molex; Conn Orientation: Right Angle; Is Female: yes; Shielding: true; Pitch: 0.65mm; Number Of Contacts: 5; Voltage Rating: 30V; Current Rating: 1.8A; Device Class L2: USB Connectors; Digikey Description: CONN RCPT USB2.0 MICRO B SMD R/A; Height: 2.945mm; RoHS: TRUE; ComponentLink2Description: Datasheet; Octopart: https://octopart.com/47346-0001-molex-7164928; Automotive: No; Package: 0; Category: Conn; Device Class L1: Connectors; Usb Standard: USB 2.0; Temperature: -30°C to +85°C; Temperature Range Low: -30°C; Footprint Url: https://www.molex.com/pdm_docs/sd/473460001_sd.pdf; ComponentLink2URL: https://www.molex.com/webdocs/datasheets/pdf/en-us/0473460001_IO_CONNECTORS.pdf; Lead Free: Yes; Manufacturer Part Number: 473460001; Contact Material: Gold,Nickel; Temperature Range High: +85°C; Device Class L3: unset
R4 R5 R7 = R0603: PANASONIC - ERJ-3EKF1002V. - THICK FILM CHIP RES, 0603, 1%, PRECISION; Resistance: 10kR; Power Rating: 100mW; Temperature Coefficient: 100ppm/°C; Voltage Rating: 75V; Supplier 1: Newark; Manufacturer: Panasonic; Manufacturer Part Number: ERJ-3EKF1002V; RoHS: Yes; Category: Chip SMD Resistors; Stock 1: 27295001; Pricing 1: 5000=0.00900, 10000=0.00900 (USD); Mount: Surface Mount; Case/Package: 0603; Number of Pins: 2; Case Code (Metric): 1608; Case Code (Imperial): 0603; Contact Plating: Tin; Size Code: 0603; Min Operating Temperature: -55°C; Max Operating Temperature: 155°C; Packaging: Tape and Reel; Resistor Type: Thick Film; Number of Terminations: 2; Max Power Dissipation: 100mW; Tolerance: 1%; Series: ERJ; Construction: Rectangular; Features: Automotive AEC-Q200; Package Quantity: 1; Voltage Rating (DC): 75V; Termination: SMD/SMT; Resistance Tolerance: 1%; Technology: THICK FILM; Length: 1.6mm; Width: 0.031inch; Height: 0.45mm; Depth: 0.8mm; Radiation Hardening: No; Military Standard: Not; Lead Free: Lead Free; RoHS Compliant: Yes; REACH SVHC: No SVHC; ComponentLink1URL: https://datasheet.ciiva.com/48530/aoa0000ce2-48530988.pdf?src-supplier=Avnet; ComponentLink1Description: https://datasheet.ciiva.com/48530/aoa0000ce2-48530988.pdf?src-supplier=Avnet; ComponentLink2URL: https://datasheet.ciiva.com/24070/aoa0000ce2-24070318.pdf?src-supplier=Mouser; ComponentLink2Description: https://datasheet.ciiva.com/24070/aoa0000ce2-24070318.pdf?src-supplier=Mouser; ComponentLink3URL: https://datasheet.ciiva.com/9194/aoa0000ce2-9194199.pdf?src-supplier=Avnet; ComponentLink3Description: https://datasheet.ciiva.com/9194/aoa0000ce2-9194199.pdf?src-supplier=Avnet; ComponentLink4URL: https://datasheet.ciiva.com/30208/aoa0000ce2-30208985.pdf?src-supplier=Onlinecomponents.com; ComponentLink4Description: https://datasheet.ciiva.com/30208/aoa0000ce2-30208985.pdf?src-supplier=Onlinecomponents.com; ComponentLink5URL: https://datasheet.ciiva.com/16759/70260748-16759807.pdf?src-supplier=Allied+Electronics; ComponentLink5Description: https://datasheet.ciiva.com/16759/70260748-16759807.pdf?src-supplier=Allied+Electronics; ComponentLink6URL: https://datasheet.ciiva.com/7830/aoa0000ce2-7830729.pdf?src-supplier=Element14; ComponentLink6Description: https://datasheet.ciiva.com/7830/aoa0000ce2-7830729.pdf?src-supplier=Element14; ComponentLink7URL: https://datasheet.ciiva.com/28514/426256-28514198.pdf?src-supplier=Element14; ComponentLink7Description: https://datasheet.ciiva.com/28514/426256-28514198.pdf?src-supplier=Element14; ComponentLink8URL: https://datasheet.ciiva.com/46372/1678782-46372725.pdf?src-supplier=Element14; ComponentLink8Description: https://datasheet.ciiva.com/46372/1678782-46372725.pdf?src-supplier=Element14; ComponentLink9URL: https://datasheet.ciiva.com/16511/aoa0000ce2-16511861.pdf?src-supplier=Avnet+Asia; ComponentLink9Description: https://datasheet.ciiva.com/16511/aoa0000ce2-16511861.pdf?src-supplier=Avnet+Asia; ComponentLink10URL: https://datasheet.ciiva.com/17212/aoa0000ce2-17212105.pdf?src-supplier=Avnet+Europe; ComponentLink10Description: https://datasheet.ciiva.com/17212/aoa0000ce2-17212105.pdf?src-supplier=Avnet+Europe
U3 = CMP-2000-07570-1: USBXpress(TM) Family, 4 GPIOs, 2.2 to 3.6 V, -40 to 85 degC, 24-Pin QFN, RoHS; Manufacturer: Silicon Labs; Max Supply Voltage: 3.6V; Min Supply Voltage: 3V; Datasheet Version: Rev. 1.1, 08/2016; Max Operating Temperature: 85degC; Case\/Package: QFN; Number of Pins: 24; Min Operating Temperature: -40degC; Mounting Technology: SurfaceMount; Manufacturer URL: http://www.silabs.com/; RoHSCompliant: False; Package Reference: QFN-24-2550x2550TP_A; Datasheet URL: http://www.silabs.com/documents/public/data-sheets/cp2102n-datasheet.pdf; Package Description: 24-Pin Quad Flat No-lead Package, Body 4 x 4 mm, Pitch 0.5 mm; REACH SVHC: Unknown
U4 = comm_choke: EXC14CE900U